# Altium schematic sheet nufsr-rs485.schdoc: NUSense
size A4; Organization: Elby Designs; Address1: 9 Follan Close; Address2: Kariong; Address3: NSW 2250; Address4: Australia; Revision: 1; SheetNumber: 7; SheetTotal: 15; DrawnBy: RS485; Engineer: Laurie Biddulph; PageSetup: Record=PageOptions|CenterHorizontal=True|CenterVertical=True|PrintScale=1.38|XCorrection=1.00|YCorrection=1.00|PrintKind=1|BorderSize=5000000|LeftOffset=0|BottomOffset=0|Orientation=2|PaperLength=1000|PaperWidth=1000|Scale=100|PaperSource=7|PrintQuality=-4|MediaType=1|DitherType=10|PaperKind=A3|PrintScaleMode=1
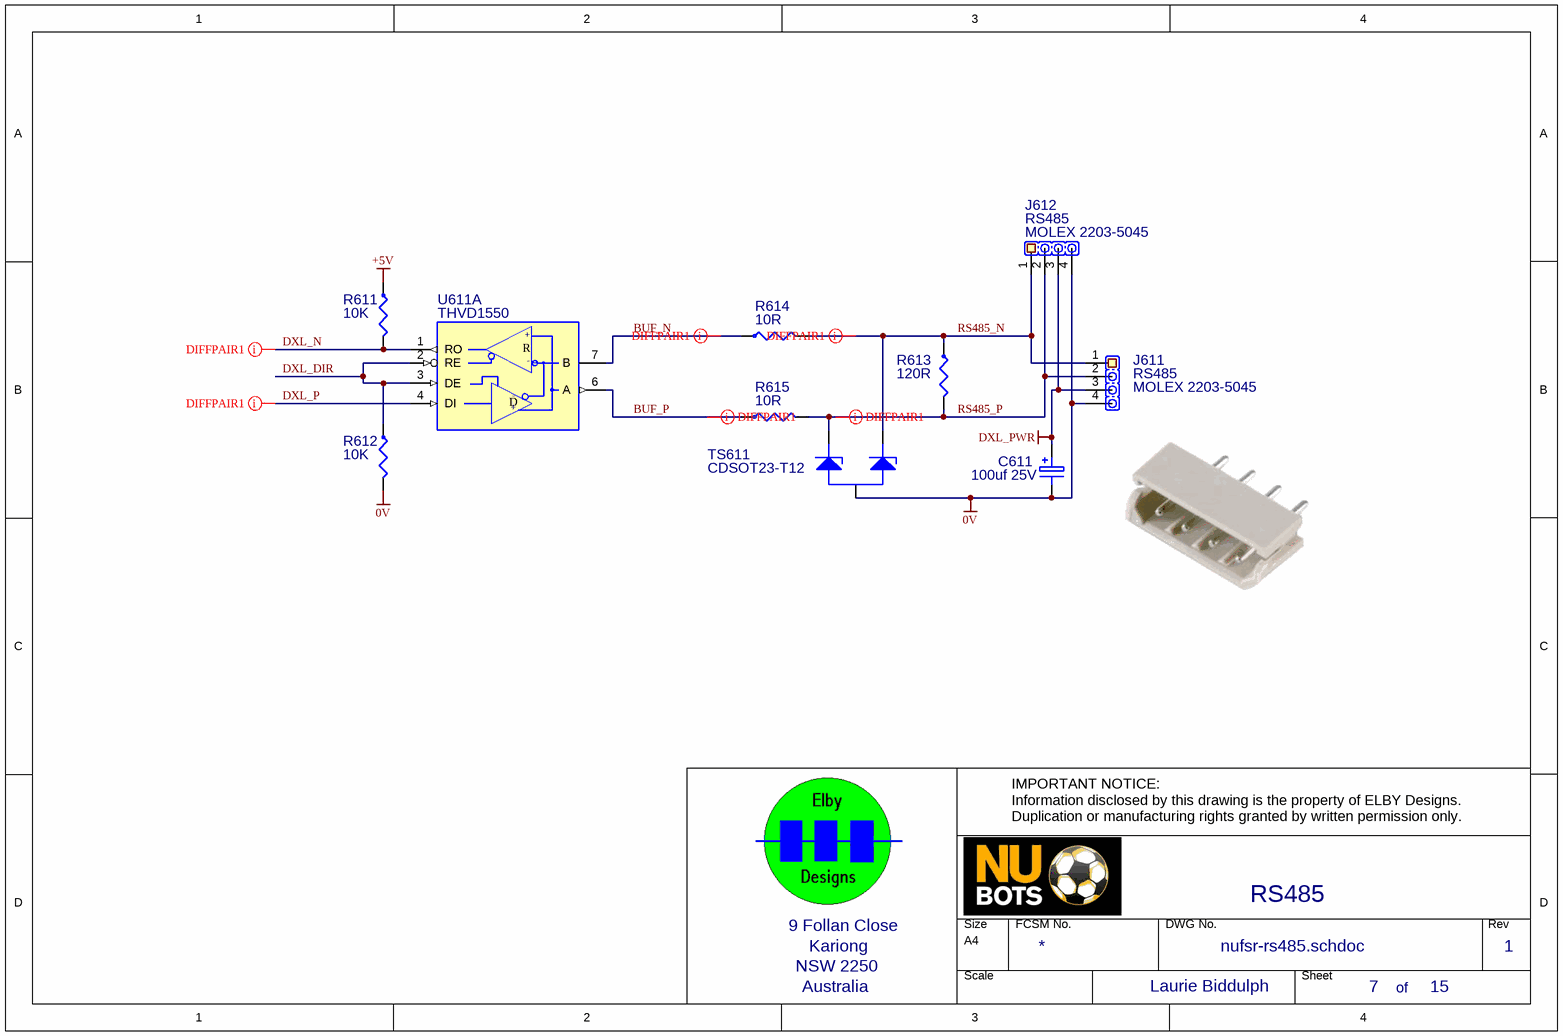
[diagram p0: nufsr-rs485.schdoc]

## Parts
C611  100uf 25V  [RB-D6.3-P2.5]
J611  RS485  PART: MOLEX 2203-5045  [CON-MOLEX_2203-5045]
J612  RS485  PART: MOLEX 2203-5045  [CON-MOLEX_2203-5045]
R611  10K  [0603(LB)]
R612  10K  [0603(LB)]
R613  120R  [0603(LB)]
R614  10R  [0603(LB)]
R615  10R  [0603(LB)]
TS611  CDSOT23-T12  [SOT-23-3(LB)]
U611  THVD1550  [SO-8(LB)]  (part A of 2)

## Nets
0V: C611.2 J611.4 J612.4 R612.2 TS611.3
+5V: R611.1
DXL_PWR: C611.1 J611.3 J612.3
BUF_N: R614.1 U611.7(B)
BUF_P: R615.1 U611.6(A)
DXL_DIR: R612.1 U611.2(RE) U611.3(DE)
DXL_N: R611.2 U611.1(RO)
DXL_P: U611.4(DI)
RS485_N: J611.1 J612.1 R613.1 R614.2 TS611.1
RS485_P: J611.2 J612.2 R613.2 R615.2 TS611.2

## Layout directives
differential pair: BUF_N, BUF_P, DXL_N, DXL_P, RS485_N, RS485_P

## Notes on the sheet
- IMPORTANT NOTICE:
  Information disclosed by this drawing is the property of ELBY Designs.
  Duplication or manufacturing rights granted by written permission only.
- of
- (in symbol THVD1550(LB), part A) +; R; -; D

## Library data of the parts
C611 = CE-100UF50V(LB): 20% 50V Aluminium Electrolytic; EMRP: CE-100UF
J611 J612 = HEADER-1X4: 1x4 Header; EMRP: JH-1X4
R611 R612 = RM-10K(LB): 0.5W 1% Metal Film Resistor; EMRP: RM-10K
R613 = RM-120R(LB): 0.5W 1% Metal Film Resistor; EMRP: RM-120R
R614 R615 = RP-10R(LB): 10R Pulse-proof; EMRP: RC-0R68-1W
TS611 = CDSOT23-T12(LB): 600V Bi-directional Transient Suppressor; EMRP: SD-TRANSORB
U611 = THVD1550(LB): RS485 Transceiver 18kV 50mbps; EMRP: SI-1-MAX485